# Altium schematic sheet PUMP DRIVER Schematic.SchDoc: Title
size A3; Date: *******; ApprovedBy: *******; CheckedBy: None; Author: *******; CompanyName: *******; DrawnBy: Name; Engineer: *******; Organization: *******; Address1: *******; Address2: *******; Address3: *******; Address4: *******; DocumentNumber: Doc Num; Revision: *******; SheetNumber: 1; SheetTotal: *******; CurrentTime: *******; CurrentDate: *******; Time: *******; DocumentFullPathAndName: *******; DocumentName: *******; ModifiedDate: *******; ImagePath: *******; ProjectName: *******; Application_BuildNumber: *******
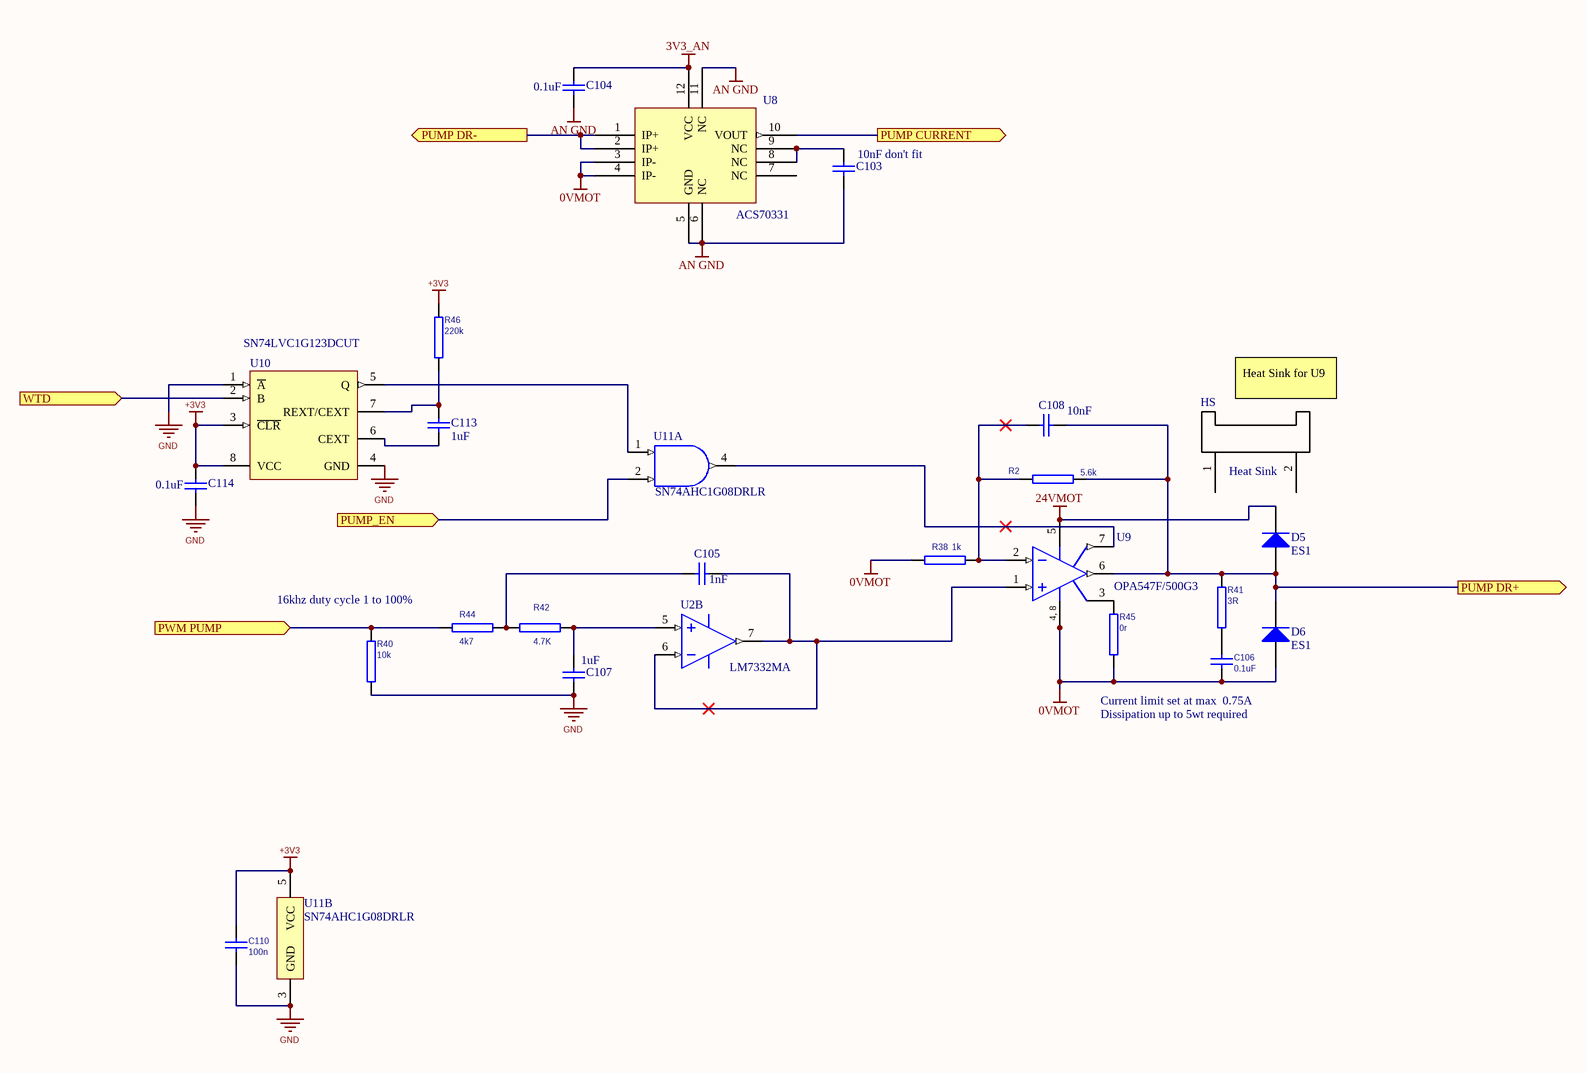
[diagram p0: PUMP DRIVER Schematic.SchDoc]

## Parts
C103  value 10nF don't fit  [C0805]  (hidden comment: Cap Semi)
C104  value 0.1uF  [C0805]  (hidden comment: Cap Semi)
C105  value 1nF  [CAPC1608X09N(0603)]  (hidden comment: Cap Semi)
C106  0.1uF  [CAPC1608X09N(0603)]
C107  value 1uF  [CAPC1608X09N(0603)]  (hidden comment: Cap Semi)
C108  value 10nF  [CAPC1608X09N(0603)]  (hidden comment: Cap Semi)
C110  100n  [CAPC1608X09N(0603)]
C113  value 1uF  [CAPC1608X09N(0603)]  (hidden comment: Cap Semi)
C114  value 0.1uF  [C0805]  (hidden comment: Cap Semi)
D5  ES1  [SMB]
D6  ES1  [SMB]
HS  Heat Sink  [ATS-PCB1073_heat_sink_D2PACK]
R2  5.6k  [RESC1608X06N(0603)]
R38  1k  [RESC1608X06N(0603)]
R40  10k  [RESC1608X06N(0603)]
R41  3R  [RESC1608X06N(0603)]
R42  4.7K  [RESC1608X06N(0603)]
R44  4k7  [RESC1608X06N(0603)]
R45  0r  [RESC1608X06N(0603)]
R46  220k  [RESC1608X06N(0603)]
U2  LM7332MA  [M08A_N]  (part B of 2)
U8  ACS70331  [Quad12]
U9  OPA547F/500G3  [TS7B_N]
U10  SN74LVC1G123DCUT  [DCU0008A_N]
U11  SN74AHC1G08DRLR  [DRL0005A_L]  (parts A,B of 2)

## Ports
PUMP CURRENT (out), PUMP DR+ (out), PUMP DR- (out), PUMP_EN (in), PWM PUMP (in), WTD (in)

## Nets
0VMOT: C106.2 D6.1(A) R38.1 R45.1 U8.3(IP-) U8.4(IP-) U9.4(V-) U9.8(V-)
3V3_AN: C104.2 U8.12(VCC)
24VMOT: D5.2(K) U9.5(V+)
+3V3: C110.1 C114.2 R46.2 U10.3(~{CLR}) U10.8(VCC) U11.5(VCC)
AN GND: C103.1 C104.1 U8.5(GND) U8.6(NC) U8.11(NC)
GND: C107.1 C110.2 C114.1 R40.1 U10.1(~{A}) U10.4(GND) U11.3(GND)
PUMP CURRENT: U8.10(VOUT) ; port PUMP CURRENT
PUMP DR+: C108.1 D5.1(A) D6.2(K) R2.2 R41.2 U9.6(OUT) ; port PUMP DR+
PUMP DR-: U8.1(IP+) U8.2(IP+) ; port PUMP DR-
PUMP_EN: U11.2(B) ; port PUMP_EN
PWM PUMP: R40.2 R44.1 ; port PWM PUMP
WTD: U10.2(B) ; port WTD
NetC103_2: C103.2 U8.8(NC) U8.9(NC)
NetC105_1: C105.1 R42.1 R44.2
NetC105_2: C105.2 U2.6(INB-) U2.7(OUTB) U9.1(IN+)
NetC106_1: C106.1 R41.1
NetC107_2: C107.2 R42.2 U2.5(INB+)
NetC108_2: C108.2 R2.1 R38.2 U9.2(IN-)
NetC113_1: C113.1 R46.1 U10.7(REXT/CEXT)
NetC113_2: C113.2 U10.6(CEXT)
NetR45_2: R45.2 U9.3(CUR_LIM)
NetU9_7: U9.7(E/S) U11.4(Y)
NetU10_5: U10.5(Q) U11.1(A)

Not connected (* = marked no-connect by the designer): HS 1 2; U8 7(NC)

## Notes on the sheet
- Heat Sink for U9
- 16khz duty cycle 1 to 100%
- Current limit set at max  0.75A
- Dissipation up to 5wt required
- Title:
- Drawn By:
- Page Contents:
- Ahmed - AA
- Checked By:
- Size:
- Date:
- File:
- License:
- Email:
- A4
- Number:
- Time:
- Revision:
- Sheet
- Website:
- of
- (in symbol CMP-0272-04175-1) 4, 8

## Library data of the parts
C103-C105 C107 C108 C113 C114 = Cap Semi: Capacitor (Semiconductor SIM Model); Published: 8-Jun-2000; LatestRevisionDate: 29-May-2009; LatestRevisionNote: IPC-7351 Footprint Added.; Publisher: Altium Limited; PackageDescription: Chip Capacitor
  C103 C104 C114: PackageReference: C1206
  C105 C107 C108 C113: PackageReference: 0603
C106 = GRM1885C1H102JA01D: Capacitor, Ceramic, 50V, ±5%, C0G NP0, -55°C to 125°C; 08 Manufacturer: Murata Electronics North America; 06 Package: 0603; 12 Author: D.Grace; 05 Footprint Type: SMD; 02 Part Number: GRM1885C1H102JA01D; 03 Description: Capacitor, Ceramic, 50V, ±5%, C0G NP0, -55°C to 125°C; 04 Value: 0.1uF; 01 Part Category: Capacitor; ComponentLink1Description: Datasheet; ComponentLink1URL: L:\Datasheet\Capacitor\c02e.pdf
C110 = GRM188R71H104KA93D: Capacitor, Ceramic, 50V, ±10%, X7R, -55°C to 125°C; 08 Manufacturer: Murata Electronics North America; 06 Package: 0603; 12 Author: D.Grace; 05 Footprint Type: SMD; 02 Part Number: GRM188R71H104KA93D; 03 Description: Capacitor, Ceramic, 50V, ±10%, X7R, -55°C to 125°C; 04 Value: 100n; 01 Part Category: Capacitor; 09 Digikey PN: 490-1519-2-ND; ComponentLink1Description: Datasheet; ComponentLink1URL: L:\Datasheet\Capacitor\c02e.pdf
D5 D6 = Diode: Default Diode; Published: 8-Jun-2000; LatestRevisionDate: 17-Jul-2002; LatestRevisionNote: Re-released for DXP Platform.; PackageVersion: Sep-1996; PackageReference: SMC; Publisher: Altium Limited; PackageDescription: DO-214-AB/SMC; 2 C-Bend Leads; Body 7.9 x 5.9 mm, inc. leads (LxW); Code_JEDEC: DO-214-AB
R2 R40 R44 = RC0603FR-07100RL: Resistor, Thick Film, 0.1W, ±1%, ±100ppm/°C; 08 Manufacturer: Yageo; 13 Reviewed By: P.Moutzouris; 06 Package: 0603; 12 Author: D.Grace; 05 Footprint Type: SMD; 02 Part Number: RC0603FR-07100RL; 03 Description: Resistor, Thick Film, 0.1W, ±1%, ±100ppm/°C; 01 Part Category: Resistor; ComponentLink1Description: Datasheet; ComponentLink1URL: L:\Datasheet\Resistor\PYu-RC0603_51_RoHS_L_4.pdf
  R2: 04 Value: 5.6k; 09 Digikey PN: 311-5.6KNTR-ND
  R40: 04 Value: 10k; 09 Digikey PN: 311-10KNTR-ND
  R44: 04 Value: 4k7; 09 Digikey PN: 311-4.7KNTR-ND
R38 = RC0603FR-07100RL: Resistor, Thick Film, 0.1W, ±1%, ±100ppm/°C; 08 Manufacturer: Yageo; 13 Reviewed By: P.Moutzouris; 04 Value: 100R; 06 Package: 0603; 12 Author: D.Grace; 05 Footprint Type: SMD; 02 Part Number: RC0603FR-07100RL; 03 Description: Resistor, Thick Film, 0.1W, ±1%, ±100ppm/°C; 09 Digikey PN: 311-100HRTR-ND; 01 Part Category: Resistor; ComponentLink1Description: Datasheet; ComponentLink1URL: L:\Datasheet\Resistor\PYu-RC0603_51_RoHS_L_4.pdf
R41 = CMP-007-0038-1: Resistor, Thick Film, 0.1W, ±1%, ±100ppm/°C; 02 Part Number: RC0603FR-071KL; 08 Manufacturer: Yageo; 13 Reviewed By: P.Moutzouris; 06 Package: 0603; 12 Author: D.Grace; 05 Footprint Type: SMD; Component Name: ERJ-8BQF3ROV; 03 Description: Resistor, Thick Film, 0.1W, ±1%, ±100ppm/°C; 04 Value: 3r; 09 Digikey PN: P17611TR-ND; 01 Part Category: Resistor; ComponentLink1Description: Datasheet; ComponentLink1URL: L:\Datasheet\Resistor\PYu-RC0603_51_RoHS_L_4.pdf
R42 = RC0603FR-07100RL: Resistor, Thick Film, 0.1W, ±1%, ±100ppm/°C; 08 Manufacturer: Yageo; 13 Reviewed By: P.Moutzouris; 04 Value: 4k7; 06 Package: 0603; 12 Author: D.Grace; 05 Footprint Type: SMD; 02 Part Number: RC0603FR-07100RL; 03 Description: Resistor, Thick Film, 0.1W, ±1%, ±100ppm/°C; 09 Digikey PN: 311-4.7KNTR-ND; 01 Part Category: Resistor; ComponentLink1Description: Datasheet; ComponentLink1URL: L:\Datasheet\Resistor\PYu-RC0603_51_RoHS_L_4.pdf
R45 = RC0603FR-07100RL: Resistor, Thick Film, 0.1W, ±1%, ±100ppm/°C; 08 Manufacturer: Yageo; 13 Reviewed By: P.Moutzouris; 04 Value: 15k; 06 Package: 0603; 12 Author: D.Grace; 05 Footprint Type: SMD; 02 Part Number: RC0603FR-07100RL; 03 Description: Resistor, Thick Film, 0.1W, ±1%, ±100ppm/°C; 09 Digikey PN: 311-15KNTR-ND; 01 Part Category: Resistor; ComponentLink1Description: Datasheet; ComponentLink1URL: L:\Datasheet\Resistor\PYu-RC0603_51_RoHS_L_4.pdf
R46 = RC0603FR-07100RL: Resistor, Thick Film, 0.1W, ±1%, ±100ppm/°C; 08 Manufacturer: Yageo; 13 Reviewed By: P.Moutzouris; 04 Value: 5.6k; 06 Package: 0603; 12 Author: D.Grace; 05 Footprint Type: SMD; 02 Part Number: RC0603FR-07100RL; 03 Description: Resistor, Thick Film, 0.1W, ±1%, ±100ppm/°C; 09 Digikey PN: 311-5.6KNTR-ND; 01 Part Category: Resistor; ComponentLink1Description: Datasheet; ComponentLink1URL: L:\Datasheet\Resistor\PYu-RC0603_51_RoHS_L_4.pdf
U2 = CMP-0055-00649-2: Dual Rail-to-Rail Input/Output, 30V, Wide Voltage Range, High Output Operational Amplifier, 8-pin Narrow SOIC; Manufacturer: National Semiconductor; CompType: Amplifiers; PackageTopMarking: NSZXTT*LM733*2MA; PowerWise: N; DatasheetVersion: Apr-2008; ComponentLink1URL: http://www.national.com/ds/LM/LM7332.pdf; RevisionNote: Component URLs added; PackageVersion: revM, May-2009; PinCount: 8; PackageReference: M08A; Code_JEDEC: MS-012-AA; RoHS: Y; ComponentLink1Description: LM7332 Datasheet; ComponentLink3URL: http://www.national.com/packaging/folders/m08a.html; ComponentLink3Description: M08A Package Page; PackageDescription: SOIC Narrow, 4.9 x 3.9 x 1.45mm, 8 Lead, 1.27mm Pitch; ComponentLink2Description: LM7332 Web Page; ComponentLink2URL: http://www.national.com/pf/LM/LM7332.html; Code_IPC: SOIC127P600-8
U8 = ASC70331
U9 = CMP-0272-04175-1: High-Voltage, High-Current Operational Amplifier, 8 to 60 V, -55 to 125 degC, 7-Pin DDPAK (KTW), Green (RoHS & no Sb/Br), Tape and Reel; PartNumber: OPA547; Supply Voltage Min: 8 V; Number of Channels: 1; Slew Rate: 24 V/us; Gain Bandwidth: 12 MHz; Supply Voltage Max: 60 V; ComponentLink2URL: http://www.ti.com/lit/ds/symlink/opa547.pdf; PackageVersion: 4201284/A, 08/2001; ComponentLink1Description: Manufacturer URL; ComponentLink3Description: Package Specification; Temperature Min: -55 degC; PackageDescription: 7-Pin Plastic Flange Mount, Body 8.89 x 10.1 mm, Pitch 1.27 mm; DatasheetVersion: SBOS100A; RoHS: TRUE; ComponentLink2Description: Datasheet; ComponentLink1URL: http://www.ti.com/; Mounting Technology: Surface Mount; Packing: Tape and Reel; Temperature Max: 125 degC; ComponentLink3URL: http://www.ti.com/litv/pdf/mpsf015; Code_JEDEC: MO-169
U10 = CMP-0859-00695-3: Single Retriggerable Monostable Multivibrator with Schmitt-Trigger Inputs, DCU0008A, SMALL T&R; Manufacturer: Texas Instruments; Schmitt Trigger: Yes; Logic: True; ICC @ Nom Voltage(Max)(mA): 0.02; VCC(Max)(V): 5.5; Output Type: CMOS; Technology Family: LVC; Bits(#): 1; Rating: Catalog; F @ Nom Voltage(Max)(Mhz): 150; VCC(Min)(V): 1.65; 3-State Output: No; tpd @ Nom Voltage(Max)(ns): 34,11,8,5.5; Output Drive (IOL/IOH)(Max)(mA): 32/-32; Input Type: CMOS/TTL; Voltage(Nom)(V): 1.8,2.5,3.3,5; DatasheetVersion: SCES586C; PackageReference: DCU0008A; Operating Temperature Range(C): -40 to 125,-40 to 85; Generic Part Number: SN74LVC1G123; Sub-Family: Monostable Multivibrator; Specialty Logic Family: Monostable Multivibrator
U11 = CMP-0859-00800-3: Single 2-Input Positive-AND Gate, DRL0005A, LARGE T&R; Manufacturer: Texas Instruments; tpd @ Nom Voltage(Max)(ns): 12.3,7.9; Bits(#): 1; Voltage(Nom)(V): 3.3,5; Output Type: CMOS; VCC(Min)(V): 2; VCC(Max)(V): 5.5; ICC @ Nom Voltage(Max)(mA): 0.01; Rating: Catalog; Gate Type: AND; Technology Family: AHC; Schmitt Trigger: No; Logic: True; F @ Nom Voltage(Max)(Mhz): 75; Output Drive (IOL/IOH)(Max)(mA): 50/-50; Generic Part Number: SN74AHC1G08; DatasheetVersion: SCLS314N; Input Type: CMOS; Operating Temperature Range(C): -55 to 125; Sub-Family: AND Gate; PackageReference: DRL0005A; 3-State Output: No